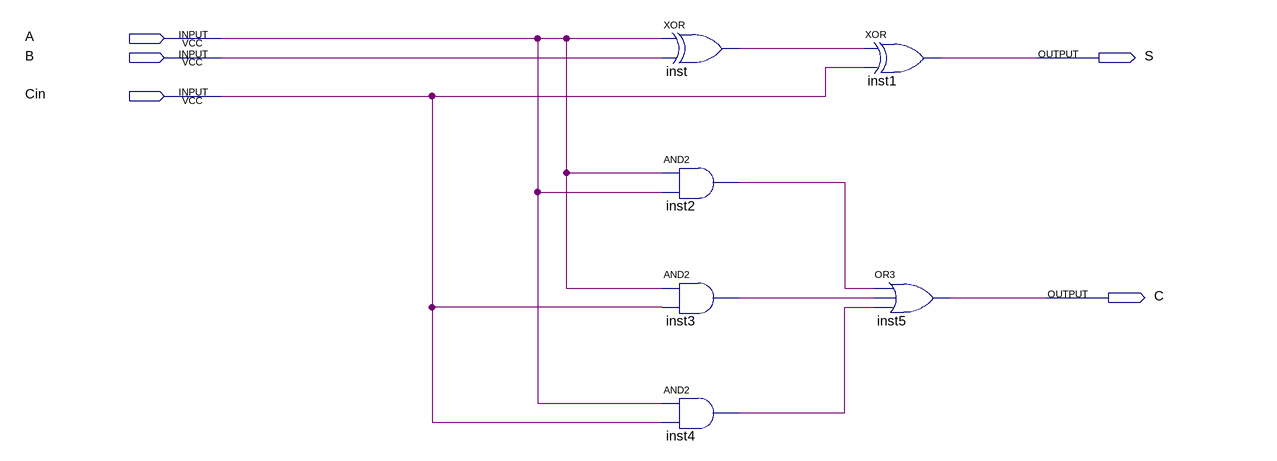
[diagram p0: schematic sheet]
// Quartus schematic FA.bdf as structural Verilog: 6 symbols, 5 pins
module FA (
  input  A,
  input  B,
  input  Cin,
  output S,
  output C
);

  wire inst2_out, inst3_out, inst4_out, inst_out;

  xor inst (inst_out, A, B);
  and inst2 (inst2_out, A, A);
  and inst3 (inst3_out, A, Cin);
  and inst4 (inst4_out, A, Cin);
  xor inst1 (S, inst_out, Cin);
  or inst5 (C, inst2_out, inst3_out, inst4_out);
endmodule
